# EAGLE schematic FT-991A_PAT (EAGLE 9.3.0)
COPYRIGHT: PY2RAF; DOCUMENT_ID: PAT-991A; PROJECT_INFO: Yaesu FT-991A Panadapter with Signal Control; PROJECT_NAME: FT-991A PAT & SDR; REVISION_ID: P

## Sheet 1 of 2
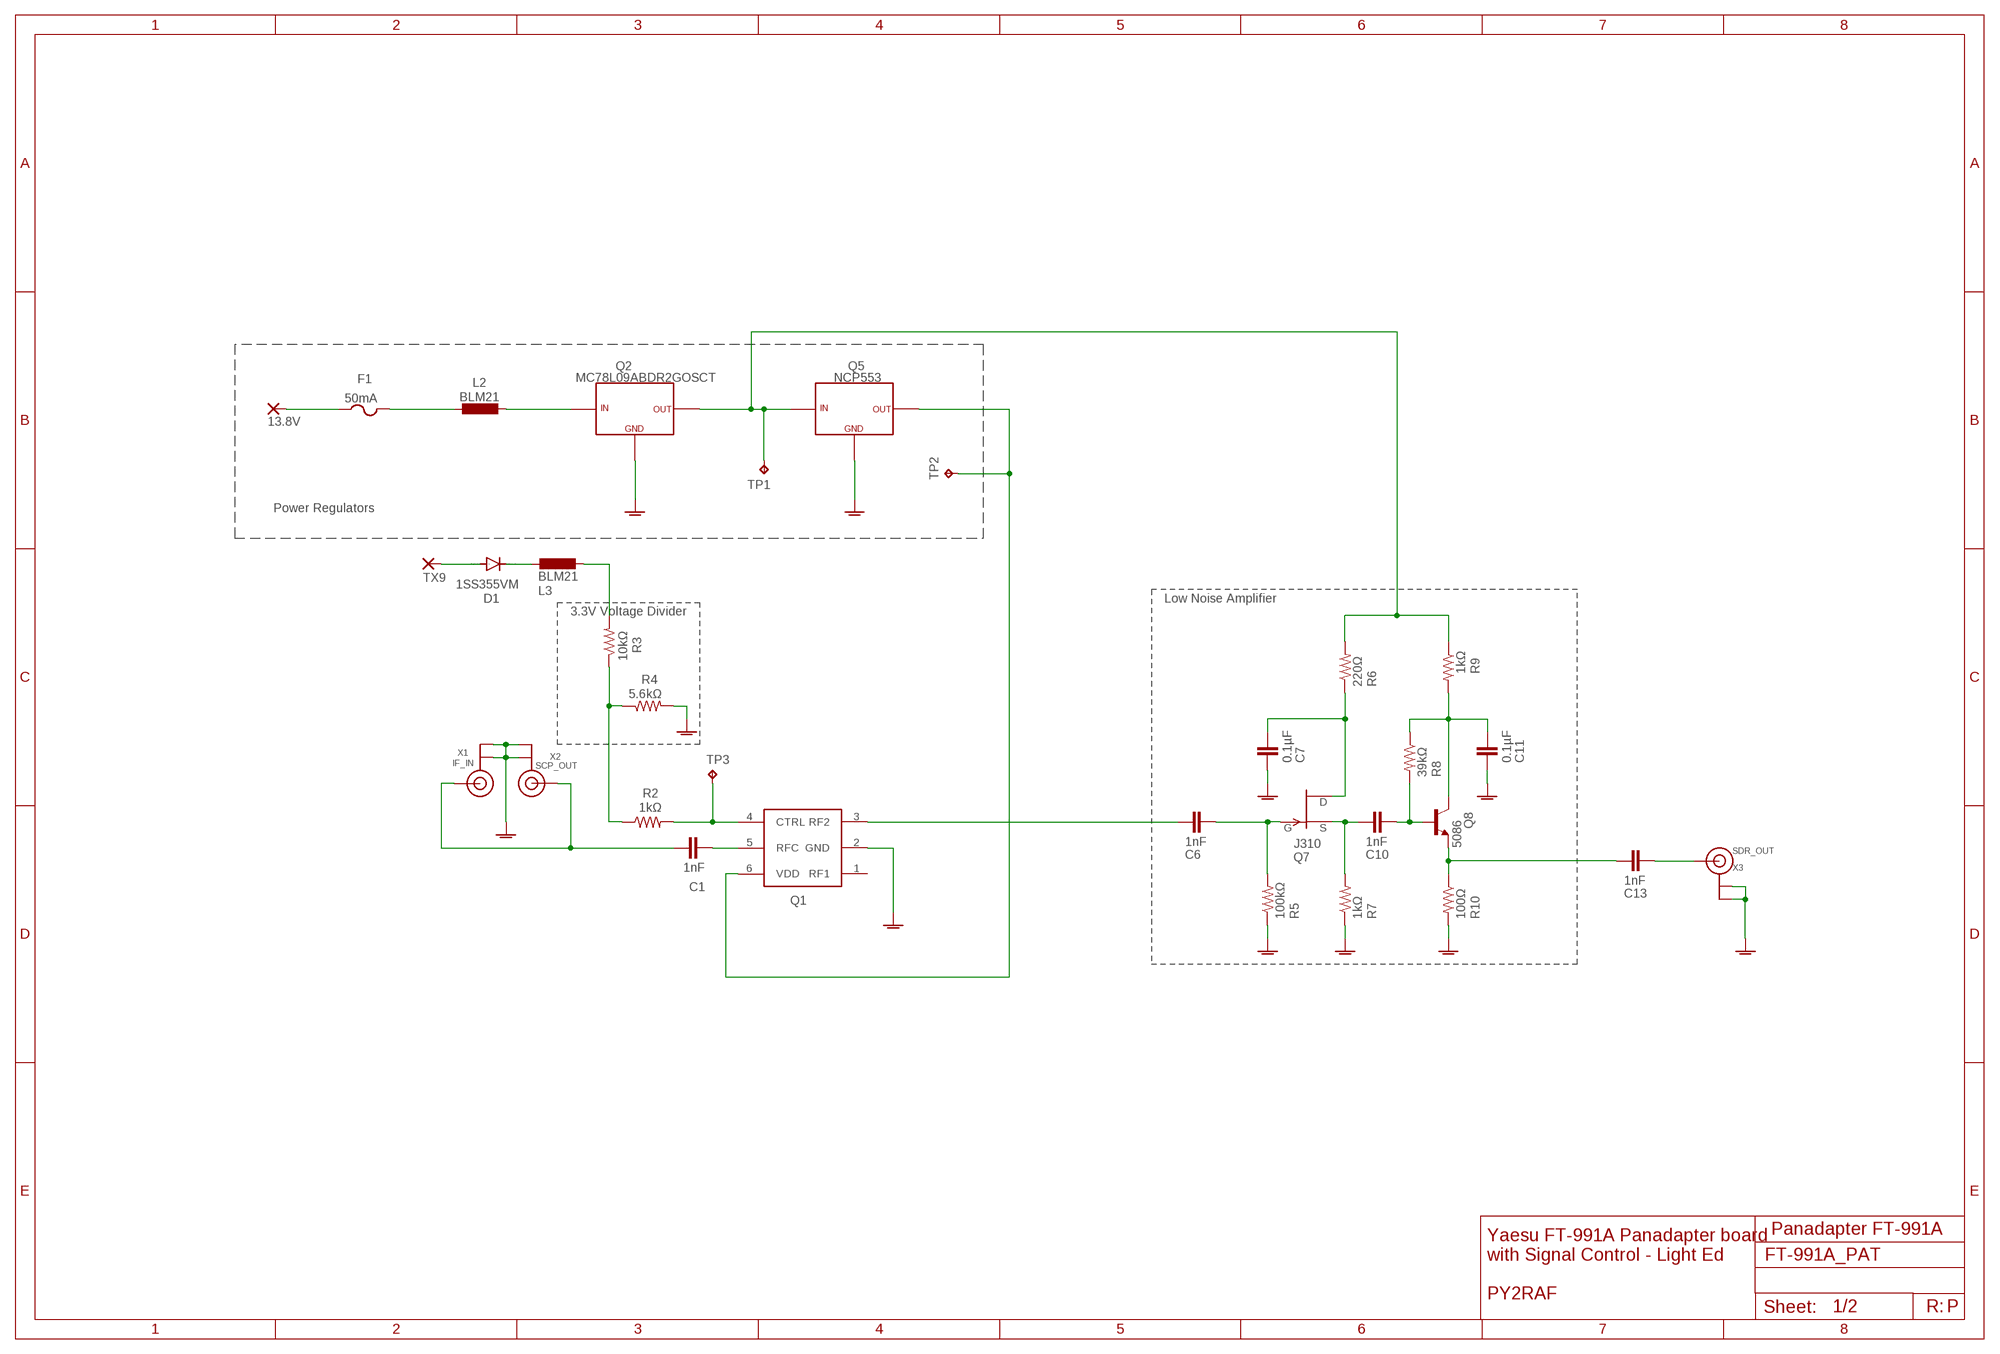
[diagram p0: schematic, sheet 1]

### Parts
13.8V  13.8V  WIREPADSMD1,27-254  [SMD1,27-2,54]
C1  1nF  C-EUC3216  [C3216]
C6  1nF  C-EUC3216  [C3216]
C7  0.1µF  C-EUC3216  [C3216]
C10  1nF  C-EUC3216  [C3216]
C11  0.1µF  C-EUC3216  [C3216]
C13  1nF  C-EUC3216  [C3216]
D1  1SS355VM  DIODE-SOD323-W  [SOD323-W]
F1  50mA  PTCFUSE-1206  [R1206]
L2  BLM21  L-EU  [L0805]
L3  BLM21  L-EU  [L0805]
PAD3  TX9  WIREPADSMD1,27-254  [SMD1,27-2,54]
Q1  PE4259  [SC-70]
Q2  MC78L09ABDR2GOSCT  [SOIC8]
Q5  NCP553  [SC-82AB]
Q7  J310  SST201  [SOT23]
Q8  5086  2SC5086  [2-2H1A]
R2  1kΩ  R-US_R3216  [R3216]
R3  10kΩ  R-US_R3216  [R3216]
R4  5.6kΩ  R-US_R3216  [R3216]
R5  100kΩ  R-US_R3216  [R3216]
R6  220Ω  R-US_R3216  [R3216]
R7  1kΩ  R-US_R3216  [R3216]
R8  39kΩ  R-US_R3216  [R3216]
R9  1kΩ  R-US_R3216  [R3216]
R10  100Ω  R-US_R3216  [R3216]
TP1  9V  TPB1,27  [B1,27]
TP2  3V  TPB1,27  [B1,27]
TP3  3V  TPB1,27  [B1,27]
X1  IF_IN  ANTENNA_U.FL  [U.FL]
X2  SCP_OUT  ANTENNA_U.FL  [U.FL]
X3  SDR_OUT  ANTENNA_U.FL  [U.FL]

### Nets
GNDA: C7.2 C11.2 Q1.2(GND) Q2.2(GN) Q2.3(GN) Q2.6(GN) Q2.7(GN) Q5.1(GN) R4.2 R5.1 R7.1 R10.2 X1.1(GND) X1.2(GND) X2.1(GND) X2.2(GND) X3.1(GND) X3.2(GND)
N$1: C13.1 Q8.2(E) R10.1
N$2: C1.2 Q1.5(RFC)
N$3: C6.1 Q1.3(RF2)
N$4: C10.2 Q8.1(B) R8.2
N$5: C10.1 Q7.2(S) R7.2
N$6: C6.2 Q7.3(G) R5.2
N$7: Q1.4(CTRL) R2.2 TP3.TP
N$8: R2.1 R3.1 R4.1
N$9: C7.1 Q7.1(D) R6.1
N$10: C11.1 Q8.3(C) R8.1 R9.2
N$18: D1.A PAD3.1(P)
N$25: L3.2 R3.2
N$26: L2.1 Q2.8(IN)
N$27: C1.1 X1.3(SIGNAL) X2.3(SIGNAL)
N$28: 13.8V.1(P) F1.1
N$32: F1.2 L2.2
N$35: D1.C L3.1
N$37: C13.2 X3.3(SIGNAL)
VCC: Q2.1(OUT) Q5.2(IN) R6.2 R9.1 TP1.TP
VDD: Q1.6(VDD) Q5.3(OUT) TP2.TP
Unconnected: Q1.1(RF1)

### Notes on the sheet
- Power Regulators
- Low Noise Amplifier
- 3.3V Voltage Divider
- Panadapter FT-991A
- Yaesu FT-991A Panadapter board
  with Signal Control - Light Ed
- PY2RAF
- R:

## Sheet 2 of 2
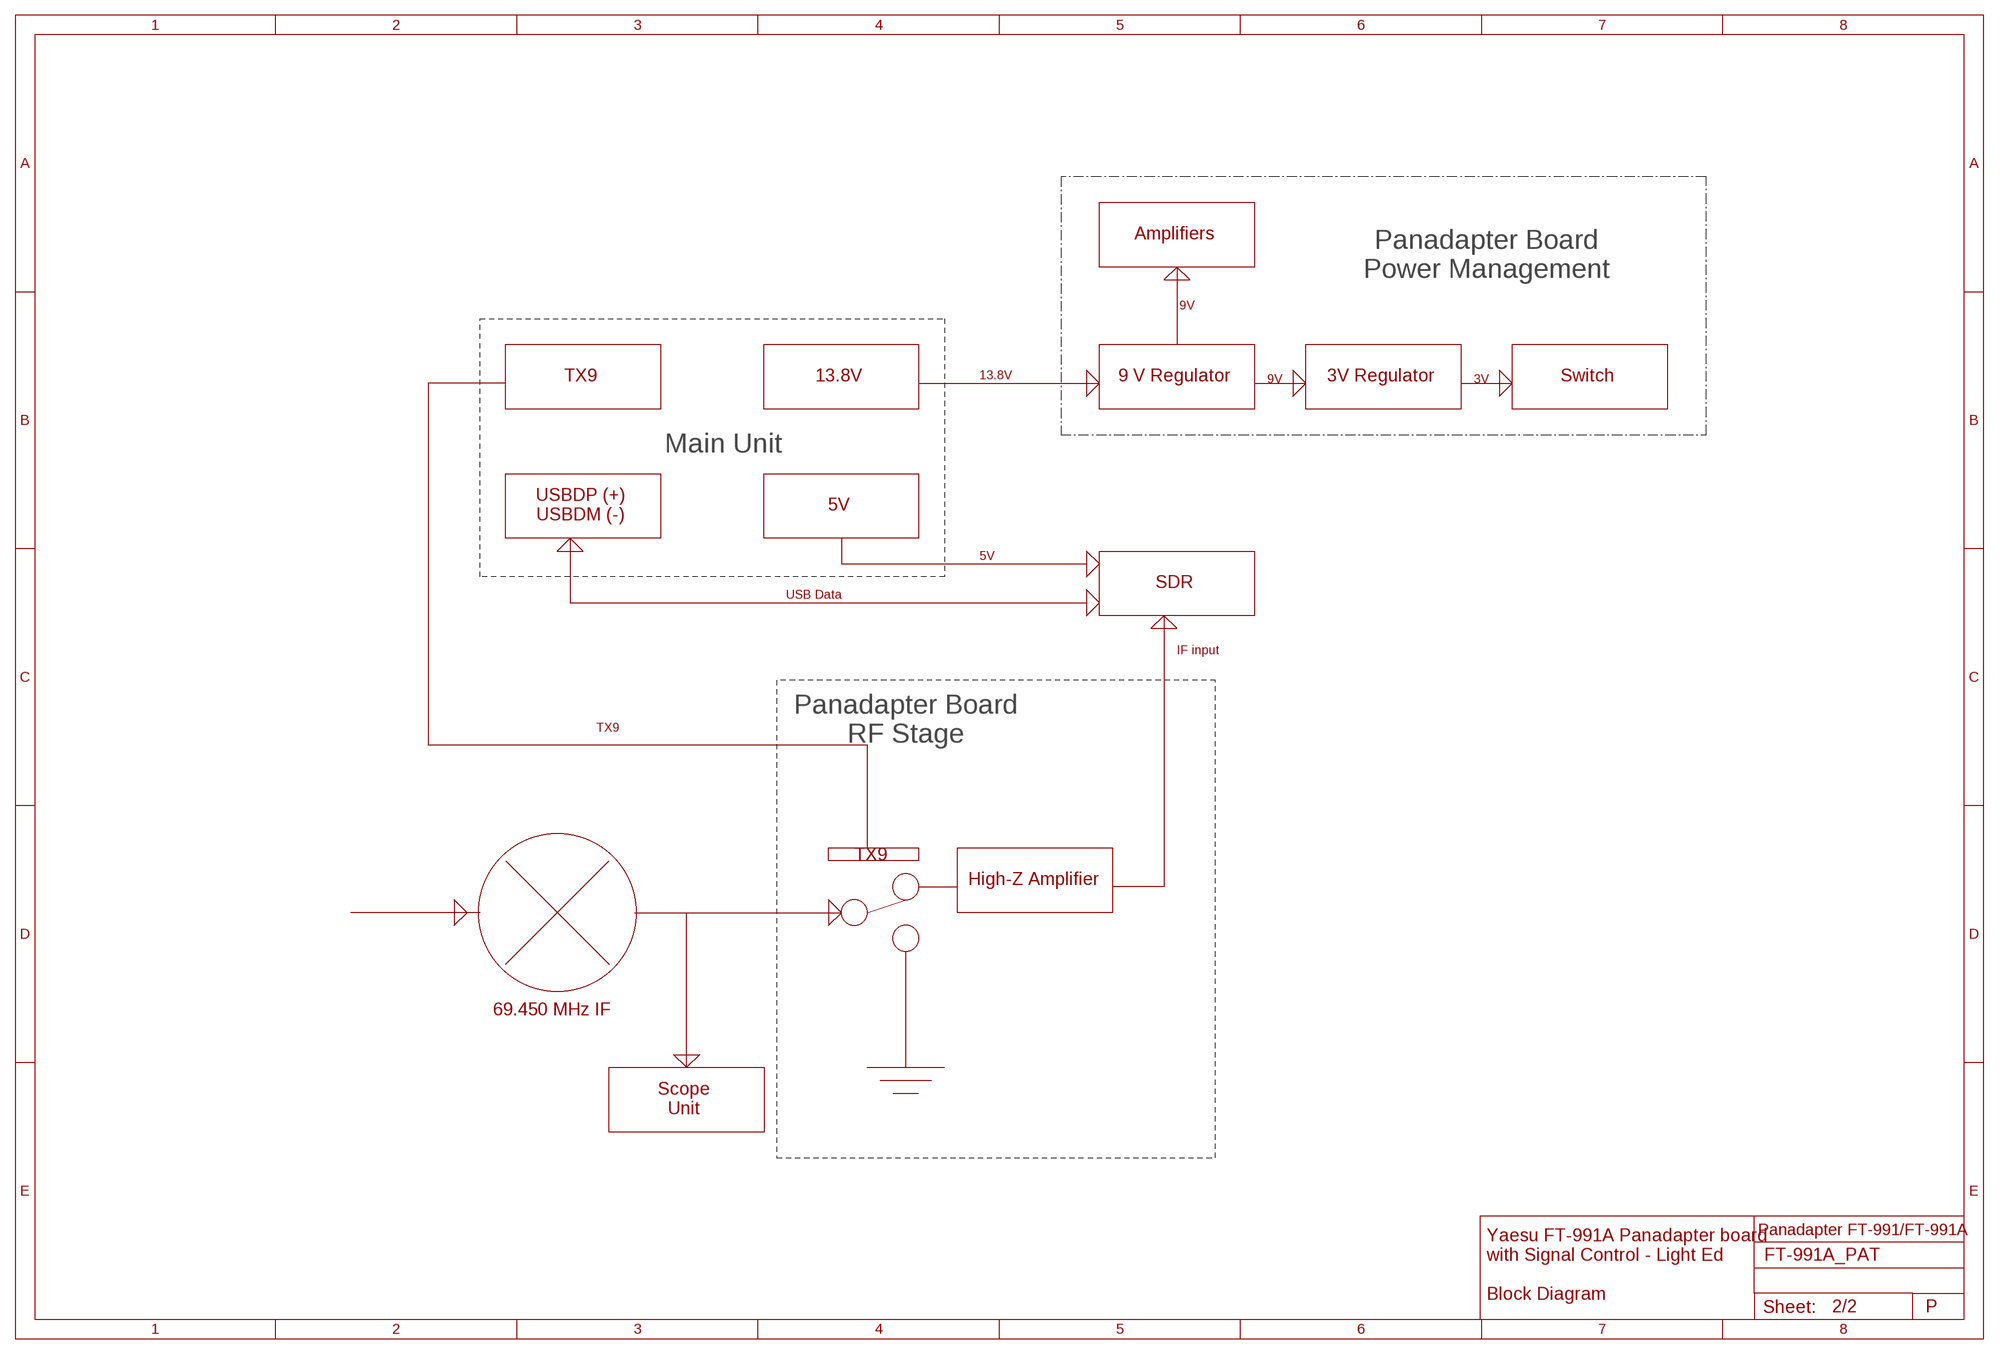
[diagram p1: schematic, sheet 2]

### Notes on the sheet
- Amplifiers
- Panadapter Board
  Power Management
- 9V
- TX9 | 13.8V | 9 V Regulator | 3V Regulator | Switch
- 13.8V
- 9V | 3V
- Main Unit
- USBDP (+)
  USBDM (-)
- 5V
- 5V
- SDR
- USB Data
- IF input
- Panadapter Board
  RF Stage
- TX9
- TX9
- High-Z Amplifier
- 69.450 MHz IF
- Scope
  Unit
- Panadapter FT-991/FT-991A
- Yaesu FT-991A Panadapter board
  with Signal Control - Light Ed
  
  Block Diagram

## Library data of the parts
13.8V PAD3 = wirepad:WIREPAD: Wire PAD connect wire on PCB
C1 C6 C7 C10 C11 C13 = rcl:C-EU: CAPACITOR, European symbol; SPICEPREFIX: C
D1 = diode:DIODE-: DIODE
F1 = adafruit:PTCFUSE: PTC fuses, resettable thermistors
L2 L3 = rcl-modified:L-EU: INDUCTOR, European symbol
Q1 = aarf:PE4259: PE4259 SPDT High Power UltraCMOS 10 MHz 3.0 GHz RF Switch Features - High ESD tolerance of 2 kV HBM - Single-pin or complementary CMOS logic control inputs - Low insertion loss: * 0.35 dB @ 1000 MHz * 0.5 dB @ 2000 MHz - Isolation of 30 dB @ 1000 MHz - Typical input 1 dB compression point of +33.5 dBm - 1.8V minimum power supply voltage - Ultra-small SC-70 package
Q2 = aarf:MC78L: 100 mA Positive VoltageRegulators; VOLTAGE: 9V
Q5 = aarf:NCP553
Q7 = transistor-fet:?20*: TEMIC / Siliconix N-Channel JFET Source: JFET-J201_Siliconix_data.pdf; SPICEPREFIX: J
Q8 = aarf:2SC5086
R2-R10 = rcl:R-US_: RESISTOR, American symbol; SPICEPREFIX: R
TP1-TP3 = testpad:TP: Test pad
X1-X3 = adafruit:ANTENNA_U.FL: U.FL Antenna Connector